# Altium project Digital board.PrjPcb
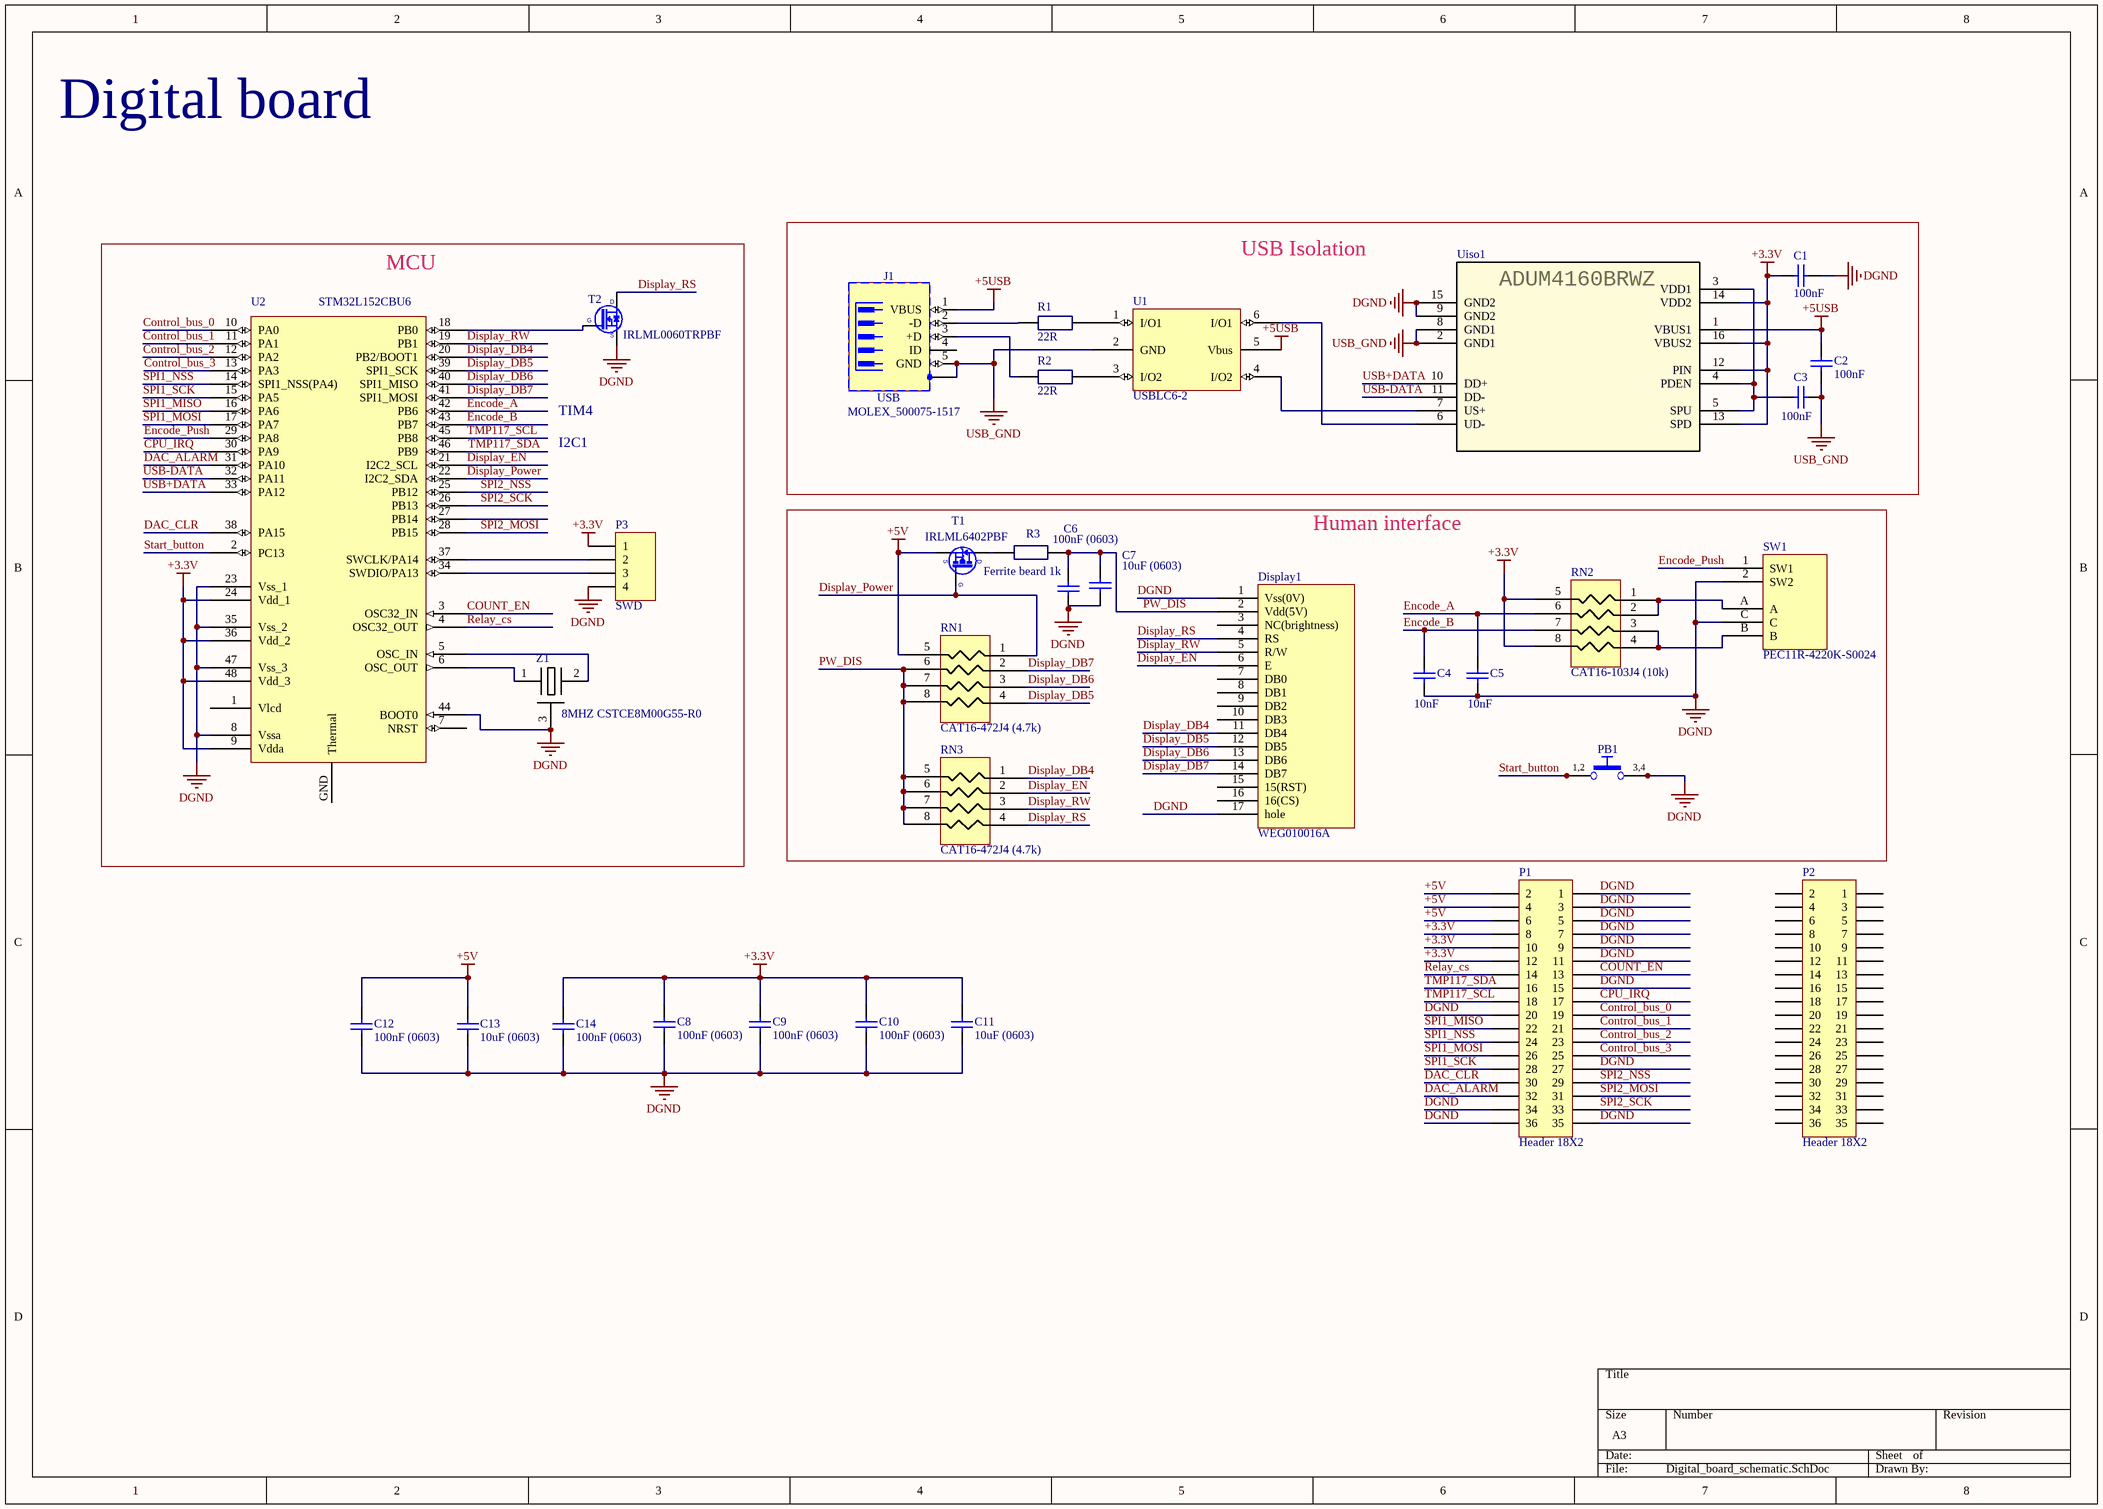
[diagram p0: Digital_board_schematic.SchDoc]
1 sheet, 33 parts. Net scope: global (net labels, ports and power ports of the same name join across sheets).
Board file: Digital_board_PCB.PcbDoc

## Sheet Digital_board_schematic.SchDoc
size A3

### Parts
C1  100nF  [CAP 0603]
C2  100nF  [CAP 0603]
C3  100nF  [CAP 0603]
C4  10nF  [CAP 0603]
C5  10nF  [CAP 0603]
C6  100nF (0603)  [CAP 0603]
C7  10uF (0603)  [CAP 0603]
C8  100nF (0603)  [CAP 0603]
C9  100nF (0603)  [CAP 0603]
C10  100nF (0603)  [CAP 0603]
C11  10uF (0603)  [CAP 0603]
C12  100nF (0603)  [CAP 0603]
C13  10uF (0603)  [CAP 0603]
C14  100nF (0603)  [CAP 0603]
Display1  WEG010016A  [WEG010016A]
J1  USB  [MOLEX_500075-1517]
P1  Header 18X2  [HDR2X18]
P2  Header 18X2  [HDR2X18]
P3  SWD  [HDR1X4]
PB1  Push Button  [PB_OMRON_B3F-1070]  (value not drawn)
R1  22R  [1608[0603]]
R2  22R  [1608[0603]]
R3  Ferrite beard 1k  [C1206]
RN1  CAT16-472J4 (4.7k)  [CAT16-470J4LF]
RN2  CAT16-103J4 (10k)  [CAT16-470J4LF]
RN3  CAT16-472J4 (4.7k)  [CAT16-470J4LF]
SW1  PEC11R-4220K-S0024  [PEC11R-4220K-S0024]
T1  IRLML6402PBF  [SOT95P237X112-3N]
T2  IRLML0060TRPBF  [SOT95P237X112-3N]
U1  USBLC6-2  [SOT23-6L]
U2  STM32L152CBU6  [UFQFPN48]
Uiso1  (no value)  [RW_16_ADI]
Z1  8MHZ CSTCE8M00G55-R0  [PRQV8.00CR5010Y000]

### Blocks framed on the sheet
USB Isolation: C1-C3 J1 R1 R2 U1 Uiso1
MCU: P3 T2 U2 Z1
Human interface: C4-C7 Display1 PB1 R3 RN1-RN3 SW1 T1

### Nets
+3.3V: C1.2 C8.1 C9.1 C10.1 C11.1 C14.1 P1.8 P1.10 P1.12 P3.1 RN2.5 RN2.8 U2.9(Vdda) U2.24(Vdd_1) U2.36(Vdd_2) U2.48(Vdd_3) Uiso1.12(PIN) Uiso1.13(SPD) Uiso1.14(VDD2) Uiso1.16(VBUS2)
+5USB: C2.2 J1.1(VBUS) U1.5(Vbus) Uiso1.1(VBUS1)
+5V: C12.1 C13.1 P1.2 P1.4 P1.6 RN1.5 T1.2(S)
DGND: C1.1 C4.2 C5.2 C6.2 C7.2 C8.2 C9.2 C10.2 C11.2 C12.2 C13.2 C14.2 Display1.1(Vss(0V)) Display1.17(hole) P1.1 P1.3 P1.5 P1.7 P1.9 P1.11 P1.15 P1.20 P1.27 P1.34 P1.35 P1.36 P3.4 PB1.3 PB1.4 SW1.2(SW2) SW1.C T2.2(S) U2.8(Vssa) U2.23(Vss_1) U2.35(Vss_2) U2.44(BOOT0) U2.47(Vss_3) Uiso1.9(GND2) Uiso1.15(GND2) Z1.3
USB_GND: C2.1 C3.1 J1.5(GND) J1.6(SH) U1.2(GND) Uiso1.2(GND1) Uiso1.8(GND1)
Control_bus_0: P1.19 U2.10(PA0)
Control_bus_1: P1.21 U2.11(PA1)
Control_bus_2: P1.23 U2.12(PA2)
Control_bus_3: P1.25 U2.13(PA3)
COUNT_EN: P1.13 U2.3(OSC32_IN)
CPU_IRQ: P1.17 U2.30(PA9)
DAC_ALARM: P1.32 U2.31(PA10)
DAC_CLR: P1.30 U2.38(PA15)
Display_DB4: Display1.11(DB4) RN3.1 U2.20(PB2/BOOT1)
Display_DB5: Display1.12(DB5) RN1.4 U2.39(SPI1_SCK)
Display_DB6: Display1.13(DB6) RN1.3 U2.40(SPI1_MISO)
Display_DB7: Display1.14(DB7) RN1.2 U2.41(SPI1_MOSI)
Display_EN: Display1.6(E) RN3.2 U2.21(I2C2_SCL)
Display_Power: RN1.1 T1.1(G) U2.22(I2C2_SDA)
Display_RS: Display1.4(RS) RN3.4 T2.3(D)
Display_RW: Display1.5(R/W) RN3.3 U2.19(PB1)
Encode_A: C5.1 RN2.6 U2.42(PB6)
Encode_B: C4.1 RN2.7 U2.43(PB7)
Encode_Push: SW1.1(SW1) U2.29(PA8)
PW_DIS: C6.1 C7.1 Display1.2(Vdd(5V)) R3.1(A) RN1.6 RN1.7 RN1.8 RN3.5 RN3.6 RN3.7 RN3.8
Relay_cs: P1.14 U2.4(OSC32_OUT)
SPI1_MISO: P1.22 U2.16(PA6)
SPI1_MOSI: P1.26 U2.17(PA7)
SPI1_NSS: P1.24 U2.14(SPI1_NSS(PA4))
SPI1_SCK: P1.28 U2.15(PA5)
SPI2_MOSI: P1.31 U2.28(PB15)
SPI2_NSS: P1.29 U2.25(PB12)
SPI2_SCK: P1.33 U2.26(PB13)
Start_button: PB1.1 PB1.2 U2.2(PC13)
TMP117_SCL: P1.18 U2.45(PB8)
TMP117_SDA: P1.16 U2.46(PB9)
USB+DATA: U2.33(PA12) Uiso1.10(DD+)
USB-DATA: U2.32(PA11) Uiso1.11(DD-)
NetC3_2: C3.2 Uiso1.3(VDD1) Uiso1.4(PDEN) Uiso1.5(SPU)
NetJ1_2: J1.2(-D) R1.2
NetJ1_3: J1.3(+D) R2.2
NetP3_2: P3.2 U2.37(SWCLK/PA14)
NetP3_3: P3.3 U2.34(SWDIO/PA13)
NetR1_1: R1.1(A) U1.1(I/O1)
NetR2_1: R2.1(A) U1.3(I/O2)
NetR3_2: R3.2 T1.3(D)
NetRN2_1: RN2.1 RN2.2 SW1.A
NetRN2_3: RN2.3 RN2.4 SW1.B
NetT2_1: T2.1(G) U2.18(PB0)
NetU1_4: U1.4(I/O2) Uiso1.7(US+)
NetU1_6: U1.6(I/O1) Uiso1.6(UD-)
NetU2_5: U2.5(OSC_IN) Z1.2
NetU2_6: U2.6(OSC_OUT) Z1.1

Not connected (* = marked no-connect by the designer): Display1 3(NC(brightness)) 7(DB0) 8(DB1) 9(DB2) 10(DB3) 15(15(RST)) 16(16(CS)); J1 4(ID); P2 1 2 3 4 5 6 7 8 9 10 11 12 13 14 15 16 17 18 19 20 21 22 23 24 25 26 27 28 29 30 31 32 33 34 35 36; U2 1(Vlcd) 7(NRST) 27(PB14) GND(Thermal)

### Notes on the sheet
- Digital board
- TIM4
- I2C1
- (in symbol PB_OMRON_B3F-1070) 1,2; 3,4

### Library data of the parts
C1-C14 = Cap Semi: Capacitor (Semiconductor SIM Model); Order: CC0603KRX7R8BB104; Published: 8-Jun-2000; LatestRevisionDate: 29-May-2009; LatestRevisionNote: IPC-7351 Footprint Added.; PackageReference: C1206; Publisher: Altium Limited; PackageDescription: Chip Capacitor
  C1-C3: Value: 100nF
  C4 C5: Value: 10nF
  C6 C8-C10 C12 C14: Value: 100nF (0603)
  C7 C11 C13: Value: 10uF (0603)
J1 = MOLEX_500075-1517: 5 Pin + 1 Shield USB Receptacle; Part Description: USB Mini-B Serie Type 2 Through Hole Straight Receptacle; Manufacturer: MOLEX; PressFit: No; Part Number: MOLEX_500075-1517; Component Kind: Standard; Component Type: Standard; Pin Count: 6; Family: USB; Mounted: Yes; Socket: No; SMD: No; Sense: No; Status: None; Manufacturer Part Number: 500075-1517; ComponentHeight: 7.7mm; HelpURL: \\cern.ch\dfs\Applications\Altium\Datasheets\MOLEX_500075-1517.pdf; Author: CERN DEM JLC; CreateDate: 25.07.2012; LatestRevisionDate: 25.07.2012
P1 P2 = Header 18X2: Header, 18-Pin, Dual row; System: Connector; LatestRevisionDate: 17-Jul-2002; LatestRevisionNote: Re-released for DXP Platform.; Publisher: Altium Limited
P3 = Header 4: Header, 4-Pin; LatestRevisionDate: 17-Jul-2002; LatestRevisionNote: Re-released for DXP Platform.; Publisher: Altium Limited
PB1 = PB_OMRON_B3F-1070: Push-Button Switch SPDT; Part Description: 24VDC 50mA SPST-NO Tactile Push-Button Switch (h=9.5mm); Manufacturer: OMRON; PressFit: No; Part Number: PB_OMRON_B3F-1070; Component Kind: Standard; Component Type: Standard; Pin Count: 4; PackageDescription: 6x6mm Model, Horizontal, Flat Plunger Type (without Ground Terminal) Pushbutton Switch, OMRON B3F Series; Family: Push Button; Mounted: Yes; Socket: No; SMD: No; Sense: No; Status: None; Manufacturer Part Number: B3F-1070; ComponentHeight: 9.5mm; HelpURL: \\cern.ch\dfs\Applications\Altium\Datasheets\PB_OMRON_B3F-1070.pdf; Author: CERN DEM JLC; CreateDate: 06.05.2009; LatestRevisionDate: 06.05.2009
R1-R3 = Resistor 0805: Order: CR0603-JW-220GLF; Avail: 20
  R1 R2: Value: 22R
  R3: Value: Ferrite beard 1k
RN1-RN3 = CAT16-470J4LF
T1 = IRLML6402PBF: P-CHANNEL MOSFET WITH ZENER DIODE; Part Description: -20V -3.7A P-Channel HEXFET® Power MOSFET; Manufacturer: INTERNATIONAL RECTIFIER; PressFit: No; Bonding: No; Part Number: IRLML6402PBF; Component Kind: Standard; Component Type: Standard; Device: IRLML6402PBF; PackageDescription: SOT, 0.95mm, pitch; 3 pin,1.30mm W X 2.92mm L X 1.12mm H body, IPC Medium Density; Manufacturer Part Number: IRLML6402PBF; Pin Count: 3; Case: SOT23-3; Mounted: Yes; Socket: No; SMD: Yes; Sense: No; ComponentHeight: 1.12mm; HelpURL: \\cern.ch\dfs\Applications\Altium\Datasheets\IRLML6402PBF.pdf; Author: CERN DEM JLC; CreateDate: 29.08.2011; LatestRevisionDate: 29.08.2011
T2 = IRLML0060TRPBF: N-CHANNEL MOSFET WITH DIODE; Part Description: 60V 2.7A N-Channel HEXFET® Power MOSFET; Manufacturer: INTERNATIONAL RECTIFIER; PressFit: No; Bonding: No; Part Number: IRLML0060TRPBF; Component Kind: Standard; Component Type: Standard; Device: IRLML0060TRPBF; PackageDescription: SOT, 0.95mm, pitch; 3 pin,1.30mm W X 2.92mm L X 1.12mm H body, IPC Medium Density; Manufacturer Part Number: IRLML0060TRPBF; Pin Count: 3; Case: SOT23-3; Mounted: Yes; Socket: No; SMD: Yes; Sense: No; ComponentHeight: 1.12mm; HelpURL: \\cern.ch\dfs\Applications\Altium\Datasheets\IRLML0060TRPBF.pdf; Author: CERN DEM JLC; CreateDate: 06.10.2011; LatestRevisionDate: 06.10.2011
U1 = USBLC6-2: Avail: 1; Order: USBLC6-2
Uiso1 = ADUM4160BRWZ: No Description Available; Vendor: Analog Devices Inc; Built_By: EMA_UL_Team; SourceLibrary: Analog_2015-12-15; Manufacturer_Part_Number: ADUM4160BRWZ; Copyright: Copyright (C) 2018 Accelerated Designs. All rights reserved; RefDes: RefDes; Type: DEV
Z1 = 8MHZ_cap